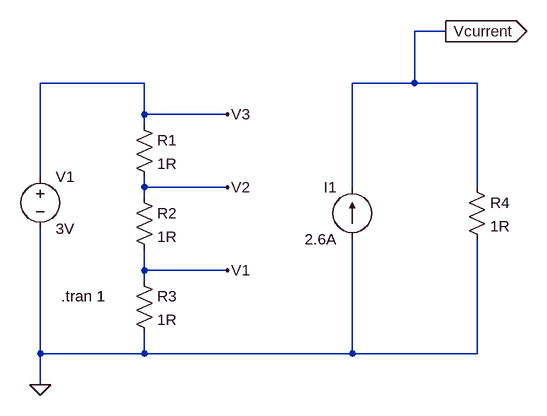
[diagram p0: schematic 02.asc]
02.asc, the LTspice schematic file:
Version 4
SHEET 1 912 680
WIRE 752 -96 704 -96
WIRE 288 -16 128 -16
WIRE 704 -16 704 -96
WIRE 704 -16 608 -16
WIRE 800 -16 704 -16
WIRE 288 32 288 -16
WIRE 416 32 288 32
WIRE 288 48 288 32
WIRE 128 128 128 -16
WIRE 288 144 288 128
WIRE 416 144 288 144
WIRE 608 144 608 -16
WIRE 800 144 800 -16
WIRE 288 160 288 144
WIRE 288 272 288 240
WIRE 416 272 288 272
WIRE 288 288 288 272
WIRE 128 400 128 208
WIRE 288 400 288 368
WIRE 288 400 128 400
WIRE 608 400 608 224
WIRE 608 400 288 400
WIRE 800 400 800 224
WIRE 800 400 608 400
WIRE 128 448 128 400
FLAG 128 448 0
FLAG 416 272 V1
FLAG 416 144 V2
FLAG 416 32 V3
FLAG 752 -96 Vcurrent
IOPIN 752 -96 Out
SYMBOL voltage 128 112 R0
WINDOW 123 0 0 Left 0
WINDOW 39 0 0 Left 0
SYMATTR InstName V1
SYMATTR Value 3V
SYMBOL res 272 32 R0
SYMATTR InstName R1
SYMATTR Value 1R
SYMBOL res 272 144 R0
SYMATTR InstName R2
SYMATTR Value 1R
SYMBOL res 272 272 R0
SYMATTR InstName R3
SYMATTR Value 1R
SYMBOL current 608 224 R180
WINDOW 0 24 80 Left 2
WINDOW 3 24 0 Left 2
WINDOW 123 0 0 Left 0
WINDOW 39 0 0 Left 0
SYMATTR InstName I1
SYMATTR Value 2.6A
SYMBOL res 784 128 R0
SYMATTR InstName R4
SYMATTR Value 1R
TEXT 160 312 Left 2 !.tran 1

The netlist it stands for:
* 02.asc
V1 V3 0 3V
R1 V3 V2 1R
R2 V2 V1 1R
R3 V1 0 1R
I1 0 Vcurrent 2.6A
R4 Vcurrent 0 1R
.tran 1
.backanno
.end